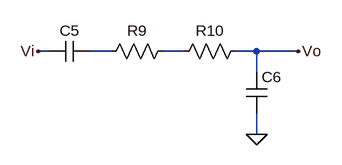
[diagram p0: schematic Draft1.asc]
Draft1.asc, the LTspice schematic file:
Version 4
SHEET 1 880 680
WIRE -16 96 -32 96
WIRE 80 96 48 96
WIRE 192 96 160 96
WIRE 304 96 272 96
WIRE 368 96 304 96
WIRE 304 128 304 96
WIRE 304 224 304 192
FLAG 304 224 0
FLAG 368 96 Vo
FLAG -32 96 Vi
SYMBOL cap 48 80 R90
WINDOW 0 0 32 VBottom 2
WINDOW 3 32 32 VTop 2
SYMATTR InstName C5
SYMATTR Value ""
SYMBOL res 176 80 R90
WINDOW 0 0 56 VBottom 2
WINDOW 3 32 56 VTop 2
SYMATTR InstName R9
SYMATTR Value ""
SYMBOL res 288 80 R90
WINDOW 0 0 56 VBottom 2
WINDOW 3 32 56 VTop 2
SYMATTR InstName R10
SYMATTR Value ""
SYMBOL cap 288 128 R0
SYMATTR InstName C6
SYMATTR Value ""

The netlist it stands for:
* Draft1.asc
C5 N001 Vi
R9 N002 N001
R10 Vo N002
C6 Vo 0
.backanno
.end